# EAGLE design MEM_P2P_1 (EAGLE 6.5.0)

## Sheet 1 of 6
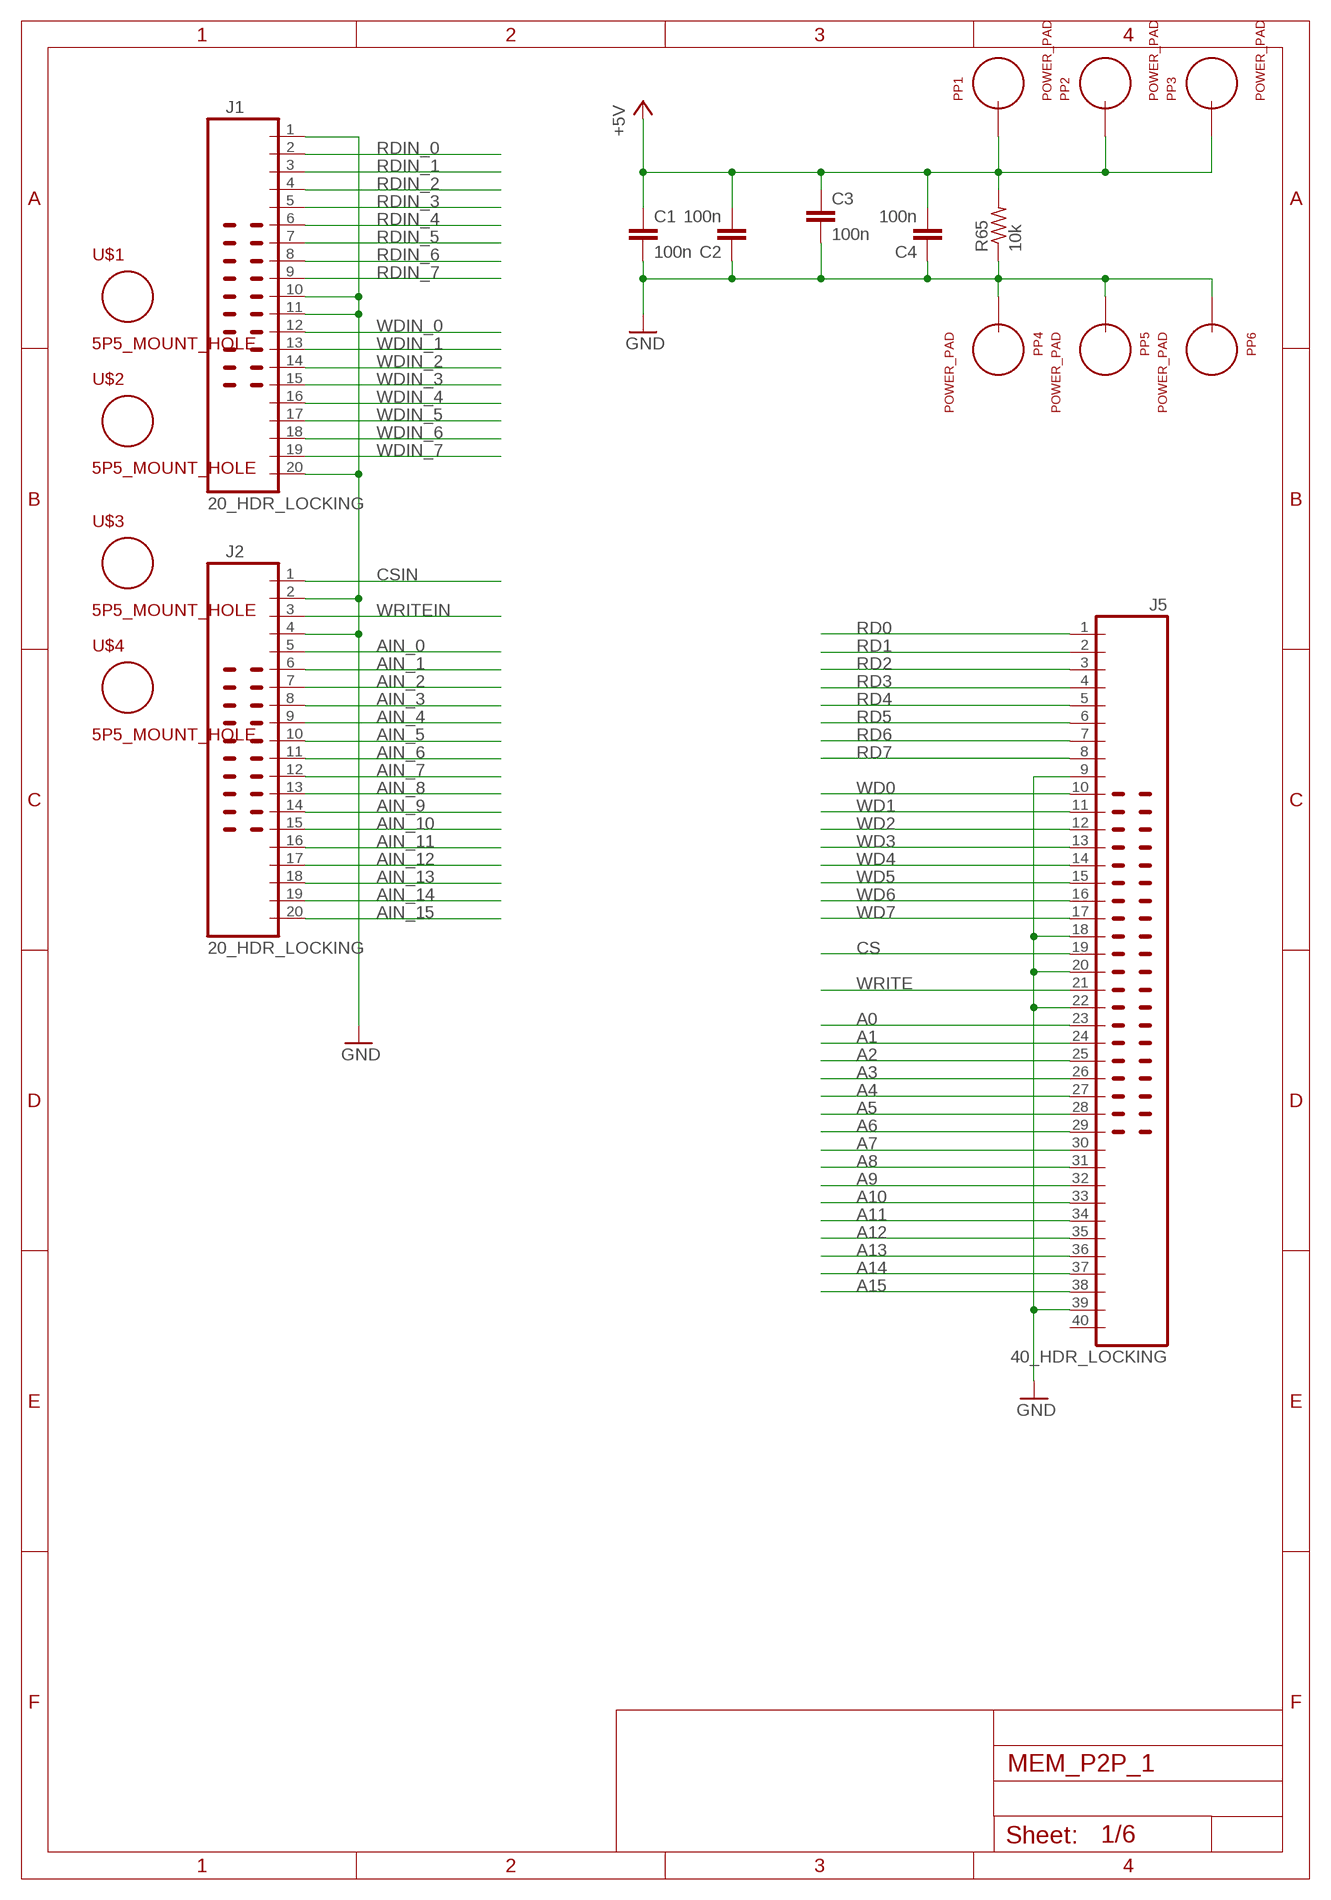
[diagram p0: schematic, sheet 1]

### Parts
C1  100n  C_P2INCH  [CAP_P2INCH]
C2  100n  C_P2INCH  [CAP_P2INCH]
C3  100n  C_P2INCH  [CAP_P2INCH]
C4  100n  C_P2INCH  [CAP_P2INCH]
J1  20_HDR_LOCKING  [20_HDR_LOCKING]
J2  20_HDR_LOCKING  [20_HDR_LOCKING]
J5  40_HDR_LOCKING  [40_HDR_LOCKING]
PP1  POWER_PAD  [POWER_PAD]
PP2  POWER_PAD  [POWER_PAD]
PP3  POWER_PAD  [POWER_PAD]
PP4  POWER_PAD  [POWER_PAD]
PP5  POWER_PAD  [POWER_PAD]
PP6  POWER_PAD  [POWER_PAD]
R65  10k  R_P2INCH  [R_P2INCH]
U$1  5P5_MOUNT_HOLE  [5P5M_HOLE]
U$2  5P5_MOUNT_HOLE  [5P5M_HOLE]
U$3  5P5_MOUNT_HOLE  [5P5M_HOLE]
U$4  5P5_MOUNT_HOLE  [5P5M_HOLE]

### Nets
+5V: C1.1 C2.2 C3.1 C4.2 PP1.1 PP2.1 PP3.1 R65.2 ; also sheet 2,3,4,5,6
A0: J5.23 ; also sheet 5
A1: J5.24 ; also sheet 5
A2: J5.25 ; also sheet 5
A3: J5.26 ; also sheet 5
A4: J5.27 ; also sheet 5
A5: J5.28 ; also sheet 5
A6: J5.29 ; also sheet 5
A7: J5.30 ; also sheet 5
A8: J5.31 ; also sheet 6
A9: J5.32 ; also sheet 6
A10: J5.33 ; also sheet 6
A11: J5.34 ; also sheet 6
A12: J5.35 ; also sheet 6
A13: J5.36 ; also sheet 6
A14: J5.37 ; also sheet 6
A15: J5.38 ; also sheet 6
AIN_0: J2.5 ; also sheet 5
AIN_1: J2.6 ; also sheet 5
AIN_2: J2.7 ; also sheet 5
AIN_3: J2.8 ; also sheet 5
AIN_4: J2.9 ; also sheet 5
AIN_5: J2.10 ; also sheet 5
AIN_6: J2.11 ; also sheet 5
AIN_7: J2.12 ; also sheet 5
AIN_8: J2.13 ; also sheet 6
AIN_9: J2.14 ; also sheet 6
AIN_10: J2.15 ; also sheet 6
AIN_11: J2.16 ; also sheet 6
AIN_12: J2.17 ; also sheet 6
AIN_13: J2.18 ; also sheet 6
AIN_14: J2.19 ; also sheet 6
AIN_15: J2.20 ; also sheet 6
CS: J5.19 ; also sheet 4
CSIN: J2.1 ; also sheet 4
GND: C1.2 C2.1 C3.2 C4.1 J1.1 J1.10 J1.11 J1.20 J2.2 J2.4 J5.9 J5.18 J5.20 J5.22 J5.39 PP4.1 PP5.1 PP6.1 R65.1 ; also sheet 2,3,4,5,6
RD0: J5.1 ; also sheet 2
RD1: J5.2 ; also sheet 2
RD2: J5.3 ; also sheet 2
RD3: J5.4 ; also sheet 2
RD4: J5.5 ; also sheet 2
RD5: J5.6 ; also sheet 2
RD6: J5.7 ; also sheet 2
RD7: J5.8 ; also sheet 2
RDIN_0: J1.2 ; also sheet 2
RDIN_1: J1.3 ; also sheet 2
RDIN_2: J1.4 ; also sheet 2
RDIN_3: J1.5 ; also sheet 2
RDIN_4: J1.6 ; also sheet 2
RDIN_5: J1.7 ; also sheet 2
RDIN_6: J1.8 ; also sheet 2
RDIN_7: J1.9 ; also sheet 2
WD0: J5.10 ; also sheet 3
WD1: J5.11 ; also sheet 3
WD2: J5.12 ; also sheet 3
WD3: J5.13 ; also sheet 3
WD4: J5.14 ; also sheet 3
WD5: J5.15 ; also sheet 3
WD6: J5.16 ; also sheet 3
WD7: J5.17 ; also sheet 3
WDIN_0: J1.12 ; also sheet 3
WDIN_1: J1.13 ; also sheet 3
WDIN_2: J1.14 ; also sheet 3
WDIN_3: J1.15 ; also sheet 3
WDIN_4: J1.16 ; also sheet 3
WDIN_5: J1.17 ; also sheet 3
WDIN_6: J1.18 ; also sheet 3
WDIN_7: J1.19 ; also sheet 3
WRITE: J5.21 ; also sheet 4
WRITEIN: J2.3 ; also sheet 4
Unconnected: J5.40

## Sheet 2 of 6
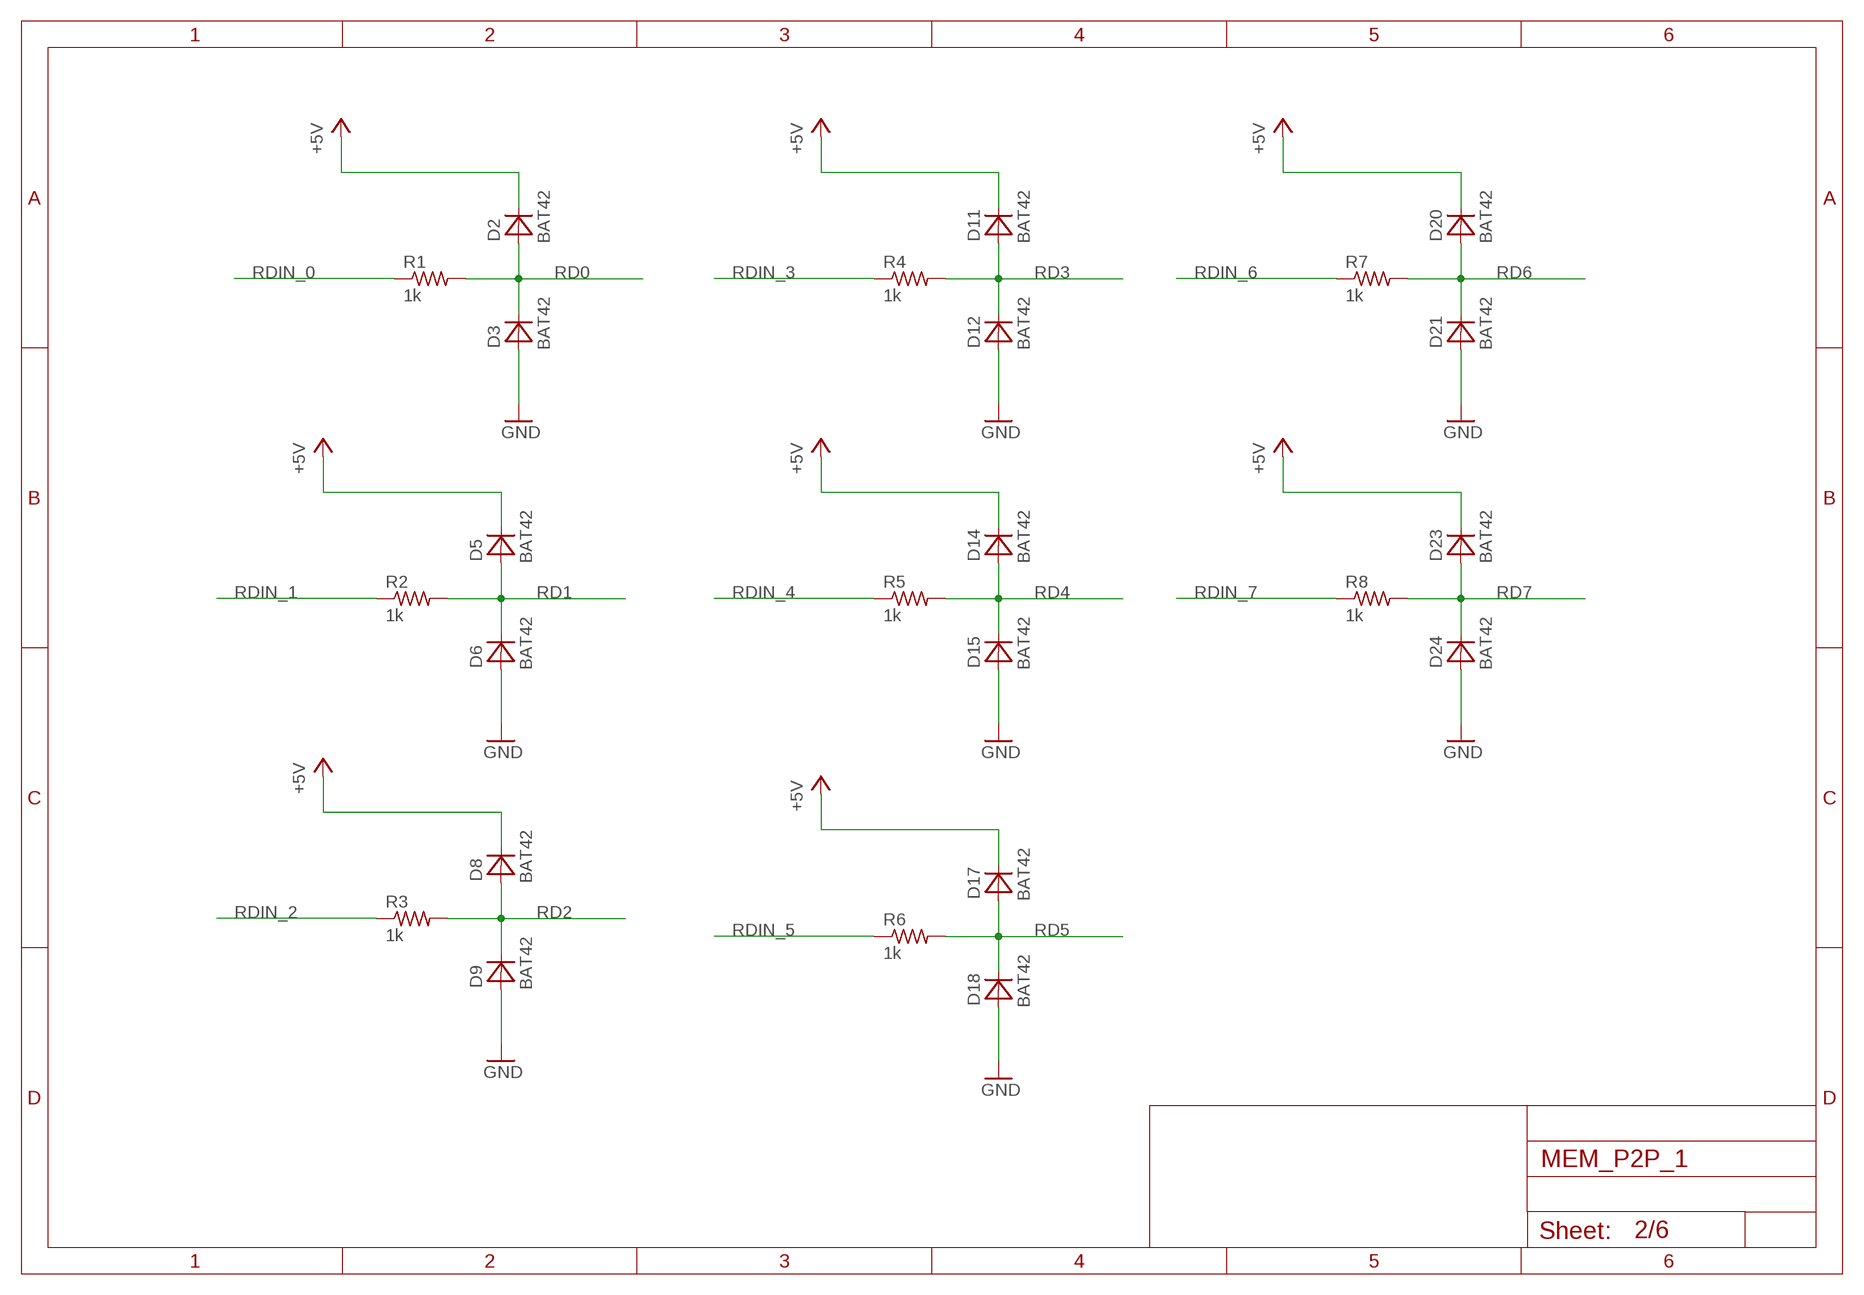
[diagram p1: schematic, sheet 2]

### Parts
D2  BAT42  [DO34-5]
D3  BAT42  [DO34-5]
D5  BAT42  [DO34-5]
D6  BAT42  [DO34-5]
D8  BAT42  [DO34-5]
D9  BAT42  [DO34-5]
D11  BAT42  [DO34-5]
D12  BAT42  [DO34-5]
D14  BAT42  [DO34-5]
D15  BAT42  [DO34-5]
D17  BAT42  [DO34-5]
D18  BAT42  [DO34-5]
D20  BAT42  [DO34-5]
D21  BAT42  [DO34-5]
D23  BAT42  [DO34-5]
D24  BAT42  [DO34-5]
R1  1k  R_P2INCH  [R_P2INCH]
R2  1k  R_P2INCH  [R_P2INCH]
R3  1k  R_P2INCH  [R_P2INCH]
R4  1k  R_P2INCH  [R_P2INCH]
R5  1k  R_P2INCH  [R_P2INCH]
R6  1k  R_P2INCH  [R_P2INCH]
R7  1k  R_P2INCH  [R_P2INCH]
R8  1k  R_P2INCH  [R_P2INCH]

### Nets
+5V: D2.C D5.C D8.C D11.C D14.C D17.C D20.C D23.C ; also sheet 1,3,4,5,6
GND: D3.A D6.A D9.A D12.A D15.A D18.A D21.A D24.A ; also sheet 1,3,4,5,6
RD0: D2.A D3.C R1.2 ; also sheet 1
RD1: D5.A D6.C R2.2 ; also sheet 1
RD2: D8.A D9.C R3.2 ; also sheet 1
RD3: D11.A D12.C R4.2 ; also sheet 1
RD4: D14.A D15.C R5.2 ; also sheet 1
RD5: D17.A D18.C R6.2 ; also sheet 1
RD6: D20.A D21.C R7.2 ; also sheet 1
RD7: D23.A D24.C R8.2 ; also sheet 1
RDIN_0: R1.1 ; also sheet 1
RDIN_1: R2.1 ; also sheet 1
RDIN_2: R3.1 ; also sheet 1
RDIN_3: R4.1 ; also sheet 1
RDIN_4: R5.1 ; also sheet 1
RDIN_5: R6.1 ; also sheet 1
RDIN_6: R7.1 ; also sheet 1
RDIN_7: R8.1 ; also sheet 1

## Sheet 3 of 6
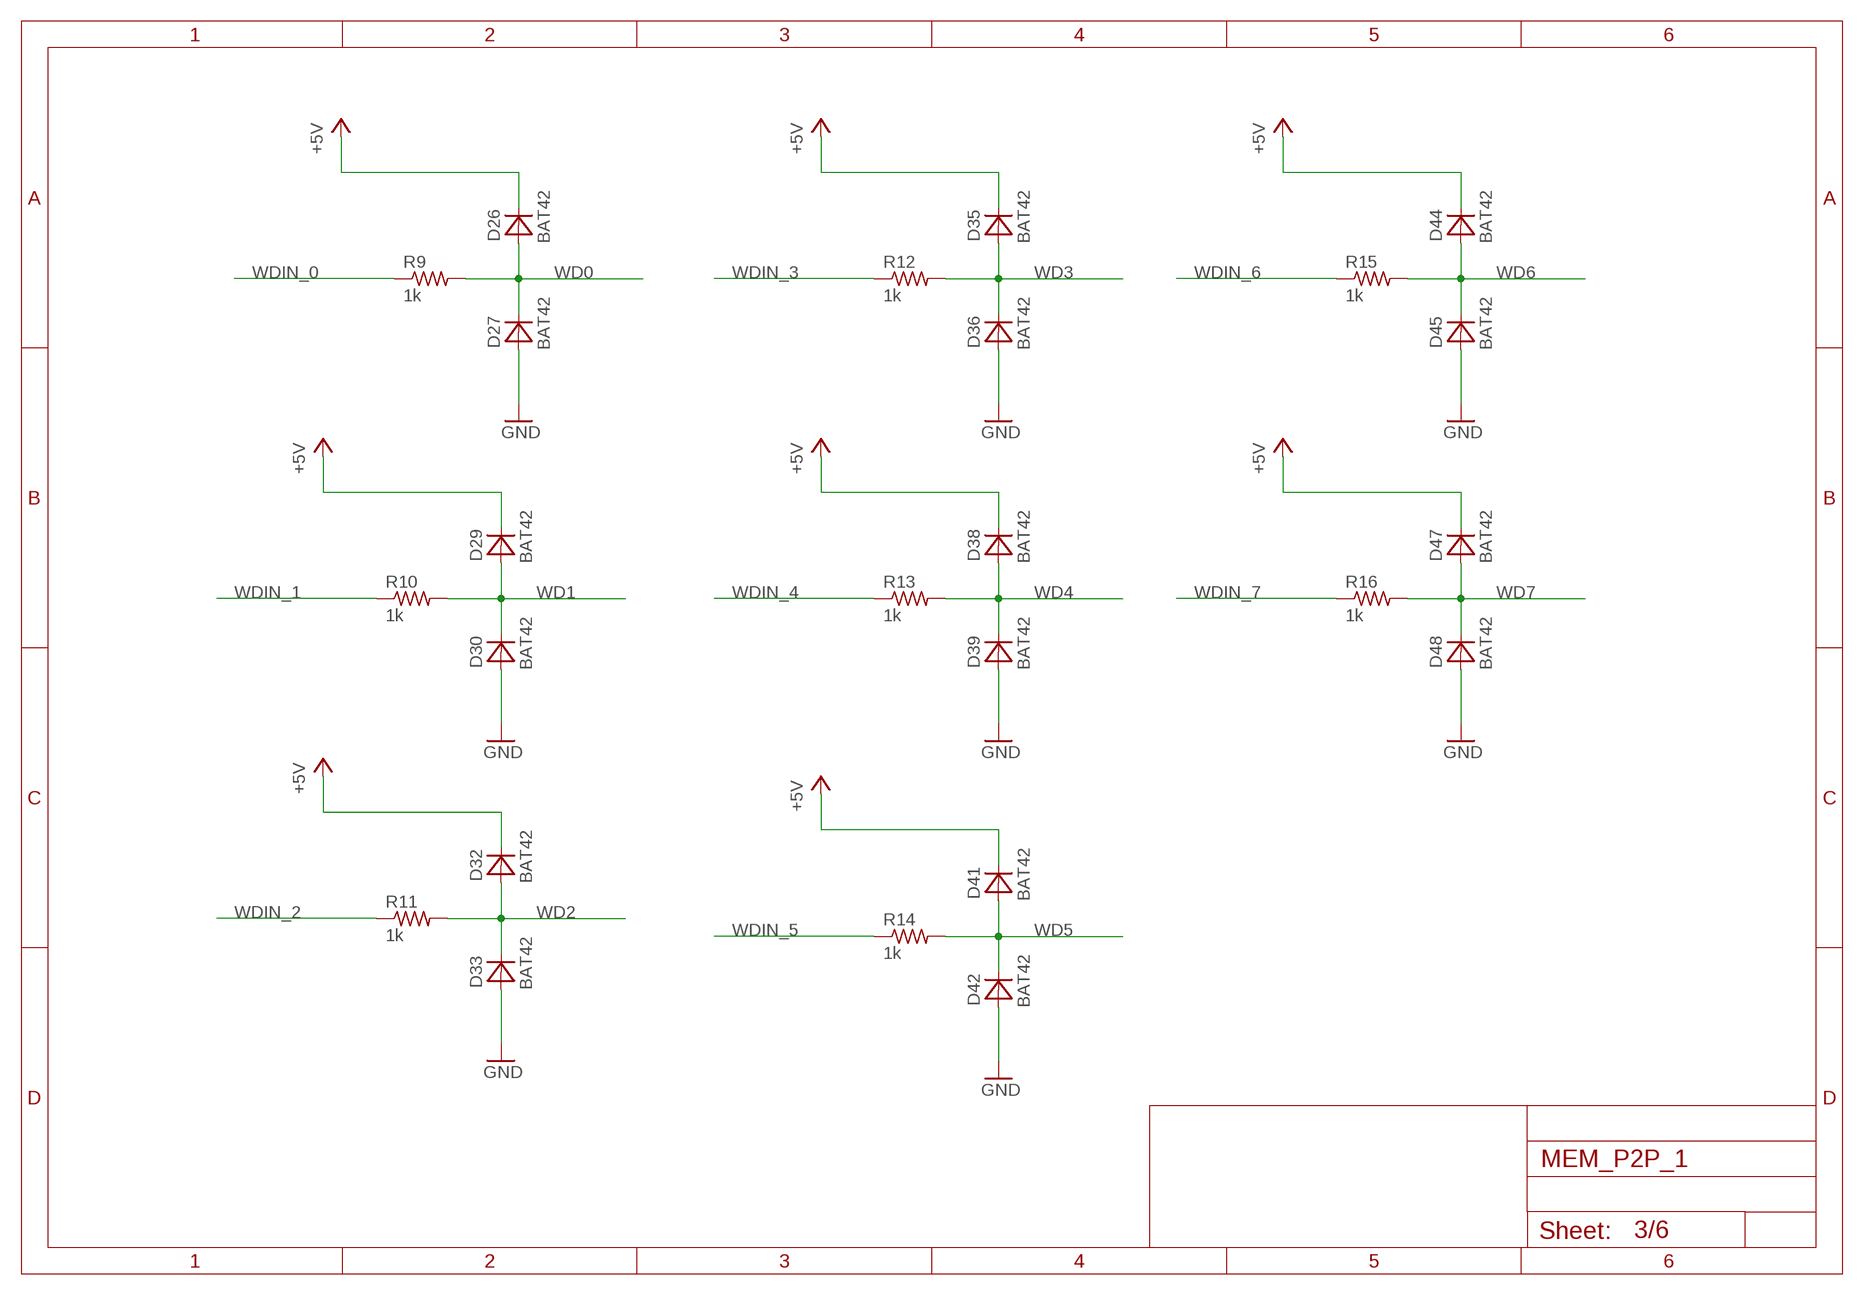
[diagram p2: schematic, sheet 3]

### Parts
D26  BAT42  [DO34-5]
D27  BAT42  [DO34-5]
D29  BAT42  [DO34-5]
D30  BAT42  [DO34-5]
D32  BAT42  [DO34-5]
D33  BAT42  [DO34-5]
D35  BAT42  [DO34-5]
D36  BAT42  [DO34-5]
D38  BAT42  [DO34-5]
D39  BAT42  [DO34-5]
D41  BAT42  [DO34-5]
D42  BAT42  [DO34-5]
D44  BAT42  [DO34-5]
D45  BAT42  [DO34-5]
D47  BAT42  [DO34-5]
D48  BAT42  [DO34-5]
R9  1k  R_P2INCH  [R_P2INCH]
R10  1k  R_P2INCH  [R_P2INCH]
R11  1k  R_P2INCH  [R_P2INCH]
R12  1k  R_P2INCH  [R_P2INCH]
R13  1k  R_P2INCH  [R_P2INCH]
R14  1k  R_P2INCH  [R_P2INCH]
R15  1k  R_P2INCH  [R_P2INCH]
R16  1k  R_P2INCH  [R_P2INCH]

### Nets
+5V: D26.C D29.C D32.C D35.C D38.C D41.C D44.C D47.C ; also sheet 1,2,4,5,6
GND: D27.A D30.A D33.A D36.A D39.A D42.A D45.A D48.A ; also sheet 1,2,4,5,6
WD0: D26.A D27.C R9.2 ; also sheet 1
WD1: D29.A D30.C R10.2 ; also sheet 1
WD2: D32.A D33.C R11.2 ; also sheet 1
WD3: D35.A D36.C R12.2 ; also sheet 1
WD4: D38.A D39.C R13.2 ; also sheet 1
WD5: D41.A D42.C R14.2 ; also sheet 1
WD6: D44.A D45.C R15.2 ; also sheet 1
WD7: D47.A D48.C R16.2 ; also sheet 1
WDIN_0: R9.1 ; also sheet 1
WDIN_1: R10.1 ; also sheet 1
WDIN_2: R11.1 ; also sheet 1
WDIN_3: R12.1 ; also sheet 1
WDIN_4: R13.1 ; also sheet 1
WDIN_5: R14.1 ; also sheet 1
WDIN_6: R15.1 ; also sheet 1
WDIN_7: R16.1 ; also sheet 1

## Sheet 4 of 6
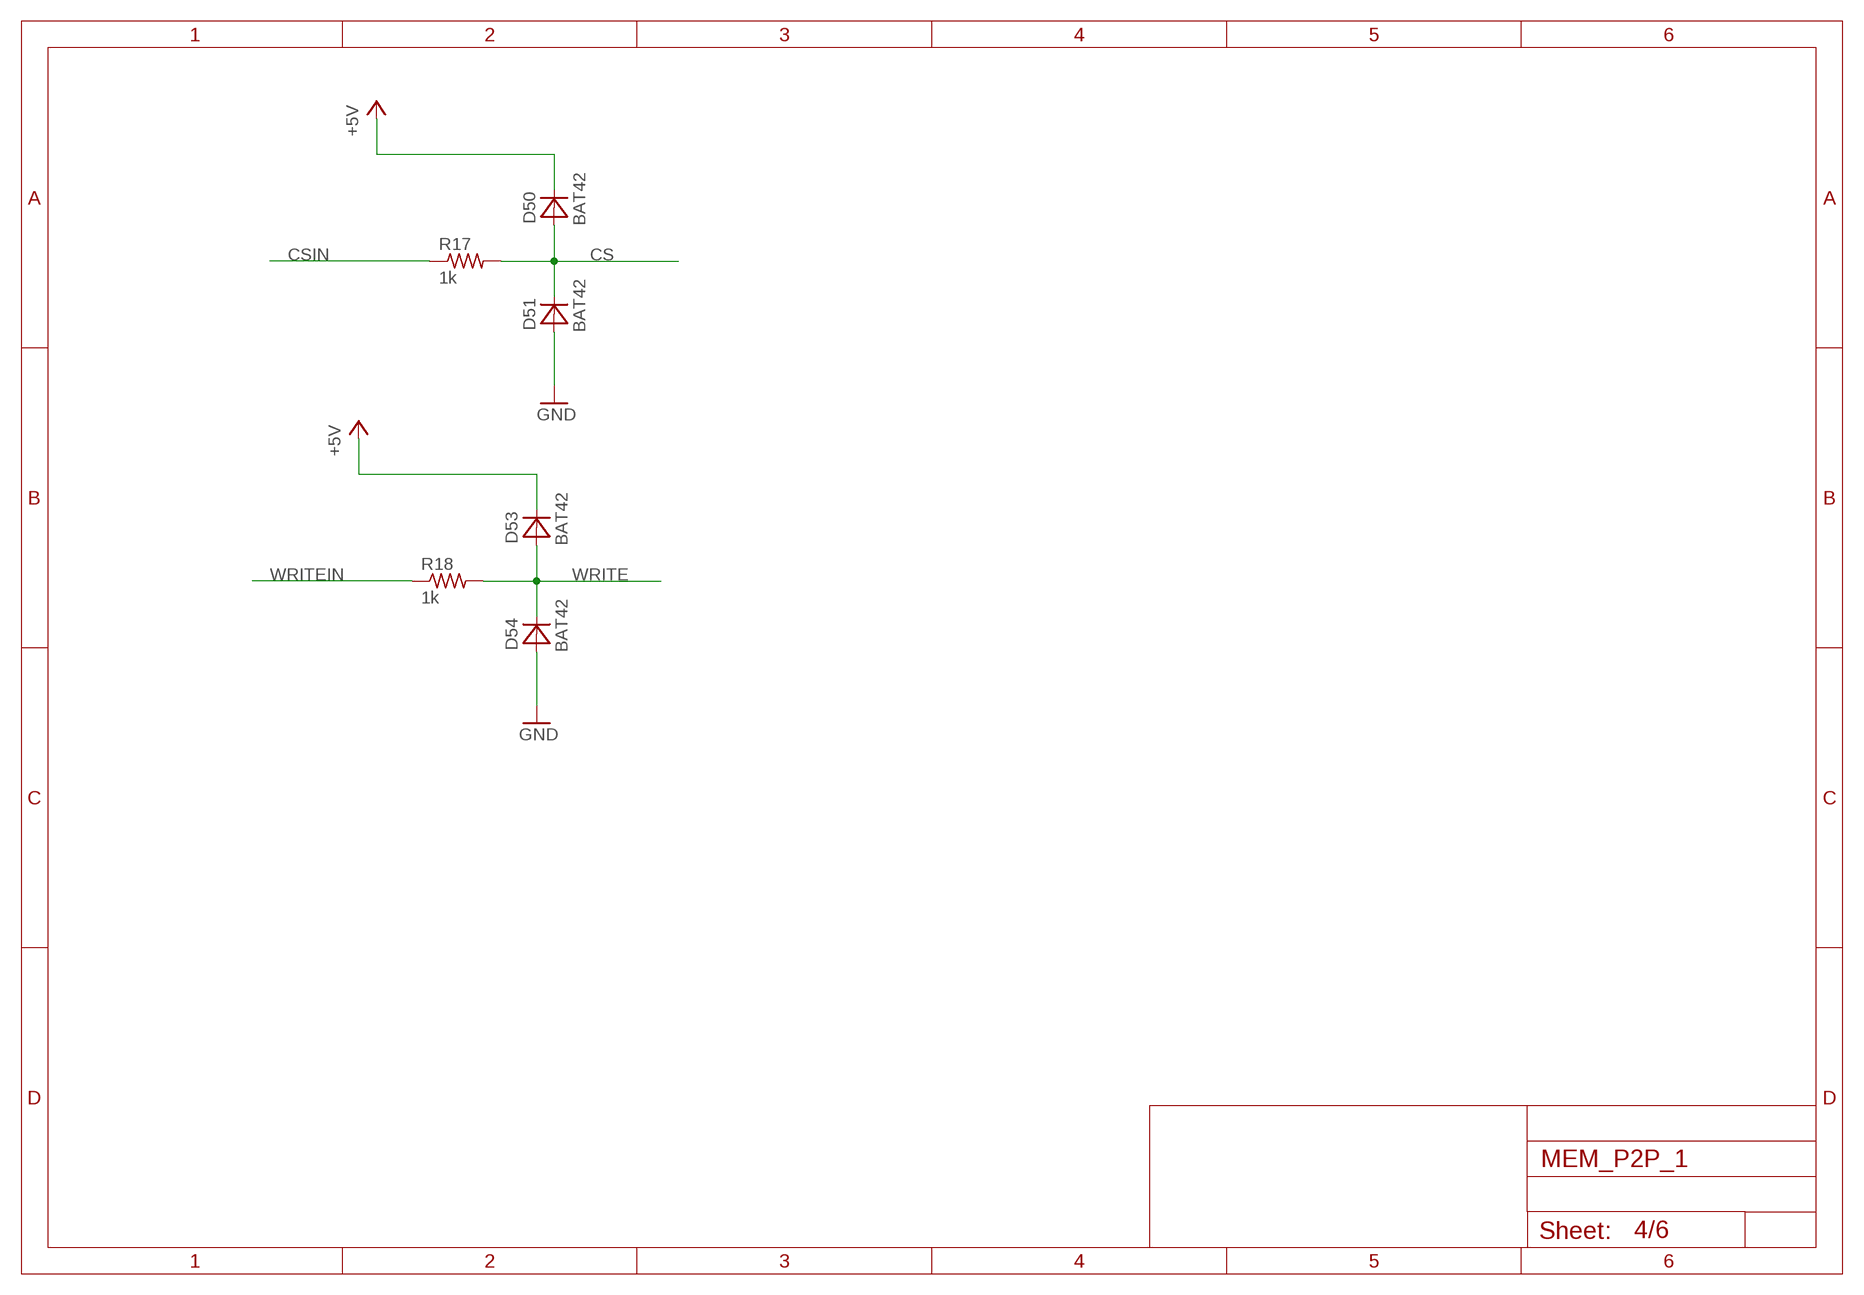
[diagram p3: schematic, sheet 4]

### Parts
D50  BAT42  [DO34-5]
D51  BAT42  [DO34-5]
D53  BAT42  [DO34-5]
D54  BAT42  [DO34-5]
R17  1k  R_P2INCH  [R_P2INCH]
R18  1k  R_P2INCH  [R_P2INCH]

### Nets
+5V: D50.C D53.C ; also sheet 1,2,3,5,6
CS: D50.A D51.C R17.2 ; also sheet 1
CSIN: R17.1 ; also sheet 1
GND: D51.A D54.A ; also sheet 1,2,3,5,6
WRITE: D53.A D54.C R18.2 ; also sheet 1
WRITEIN: R18.1 ; also sheet 1

## Sheet 5 of 6
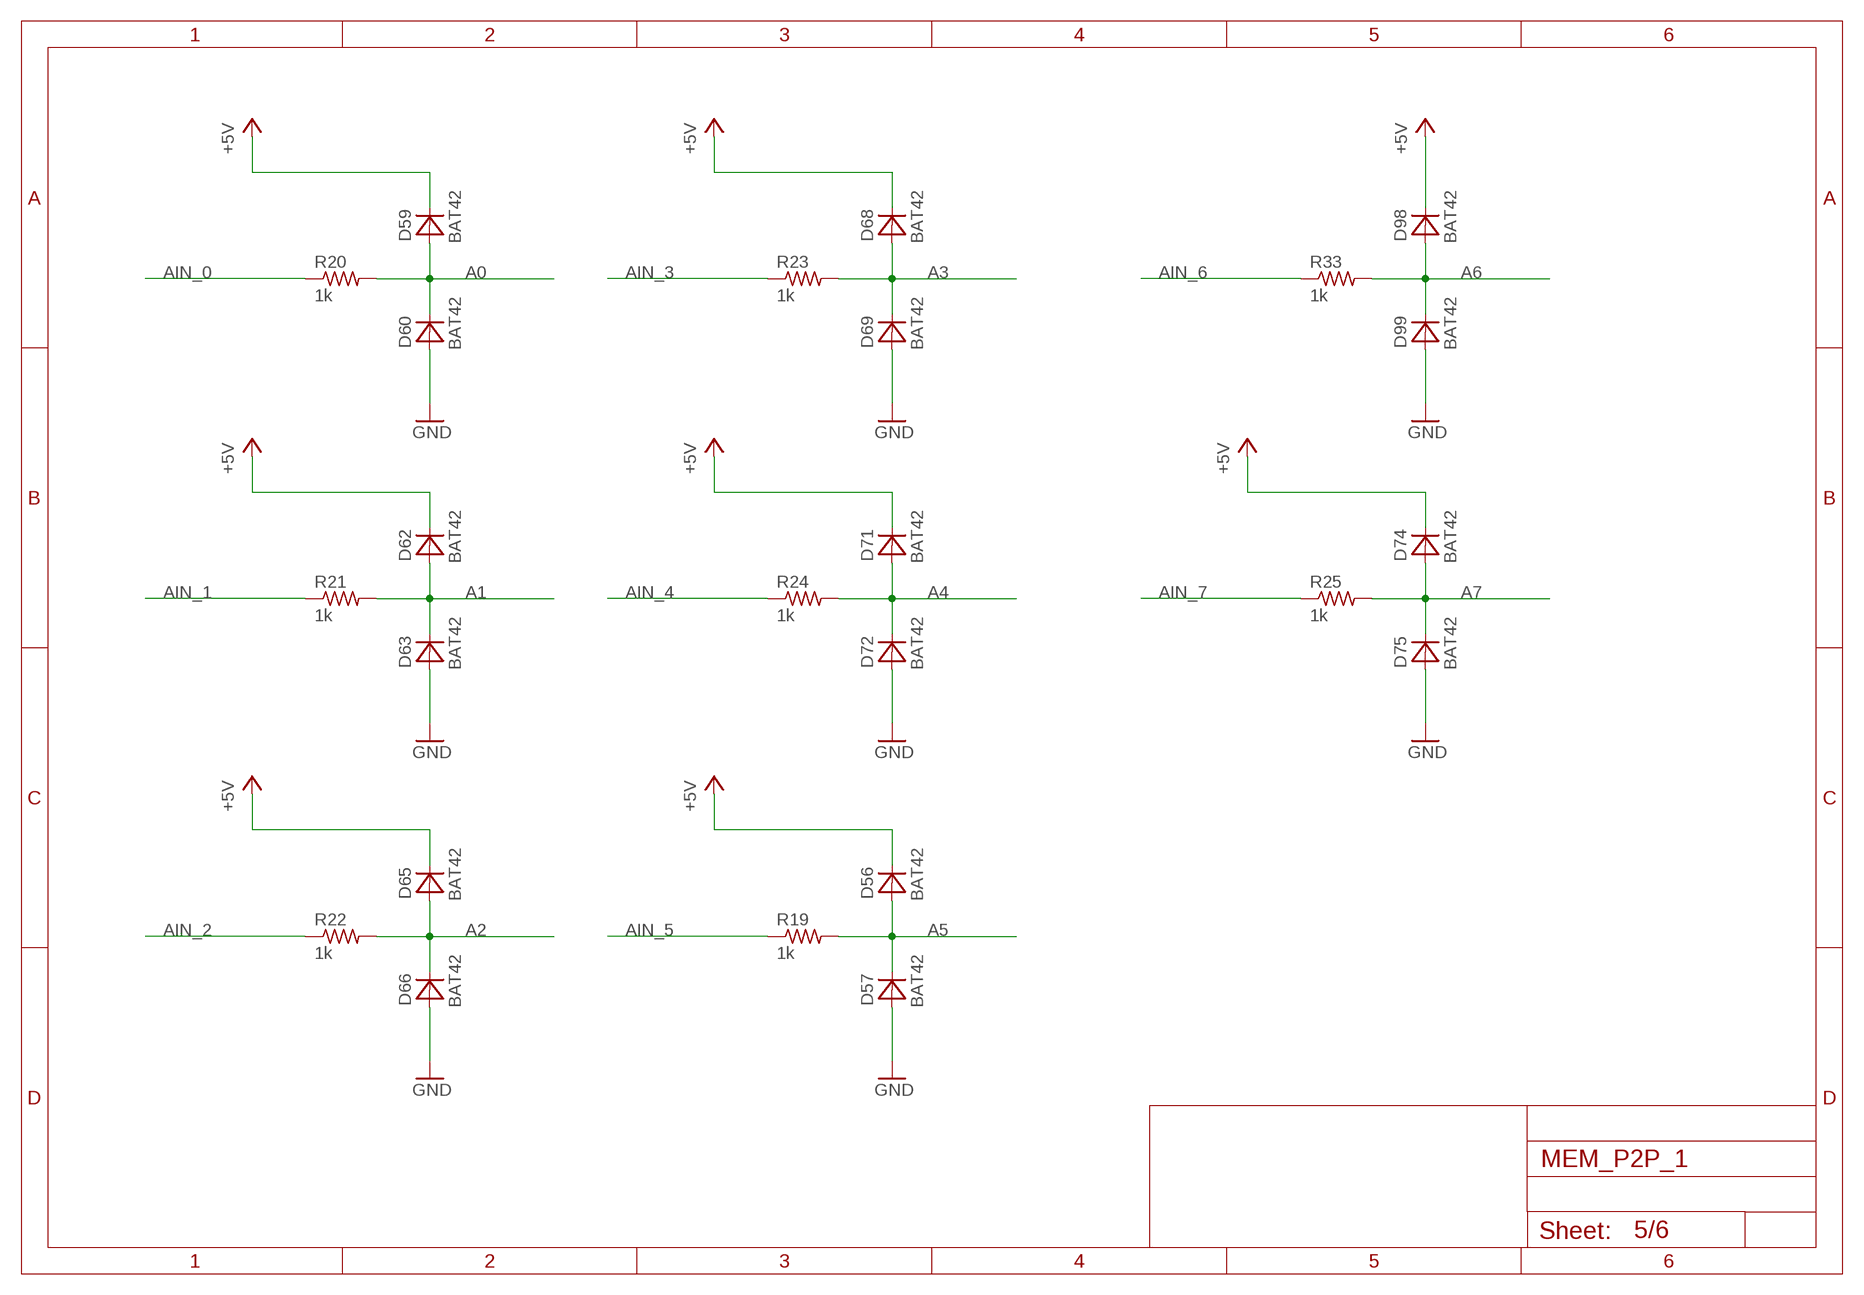
[diagram p4: schematic, sheet 5]

### Parts
D56  BAT42  [DO34-5]
D57  BAT42  [DO34-5]
D59  BAT42  [DO34-5]
D60  BAT42  [DO34-5]
D62  BAT42  [DO34-5]
D63  BAT42  [DO34-5]
D65  BAT42  [DO34-5]
D66  BAT42  [DO34-5]
D68  BAT42  [DO34-5]
D69  BAT42  [DO34-5]
D71  BAT42  [DO34-5]
D72  BAT42  [DO34-5]
D74  BAT42  [DO34-5]
D75  BAT42  [DO34-5]
D98  BAT42  [DO34-5]
D99  BAT42  [DO34-5]
R19  1k  R_P2INCH  [R_P2INCH]
R20  1k  R_P2INCH  [R_P2INCH]
R21  1k  R_P2INCH  [R_P2INCH]
R22  1k  R_P2INCH  [R_P2INCH]
R23  1k  R_P2INCH  [R_P2INCH]
R24  1k  R_P2INCH  [R_P2INCH]
R25  1k  R_P2INCH  [R_P2INCH]
R33  1k  R_P2INCH  [R_P2INCH]

### Nets
+5V: D56.C D59.C D62.C D65.C D68.C D71.C D74.C D98.C ; also sheet 1,2,3,4,6
A0: D59.A D60.C R20.2 ; also sheet 1
A1: D62.A D63.C R21.2 ; also sheet 1
A2: D65.A D66.C R22.2 ; also sheet 1
A3: D68.A D69.C R23.2 ; also sheet 1
A4: D71.A D72.C R24.2 ; also sheet 1
A5: D56.A D57.C R19.2 ; also sheet 1
A6: D98.A D99.C R33.2 ; also sheet 1
A7: D74.A D75.C R25.2 ; also sheet 1
AIN_0: R20.1 ; also sheet 1
AIN_1: R21.1 ; also sheet 1
AIN_2: R22.1 ; also sheet 1
AIN_3: R23.1 ; also sheet 1
AIN_4: R24.1 ; also sheet 1
AIN_5: R19.1 ; also sheet 1
AIN_6: R33.1 ; also sheet 1
AIN_7: R25.1 ; also sheet 1
GND: D57.A D60.A D63.A D66.A D69.A D72.A D75.A D99.A ; also sheet 1,2,3,4,6

## Sheet 6 of 6
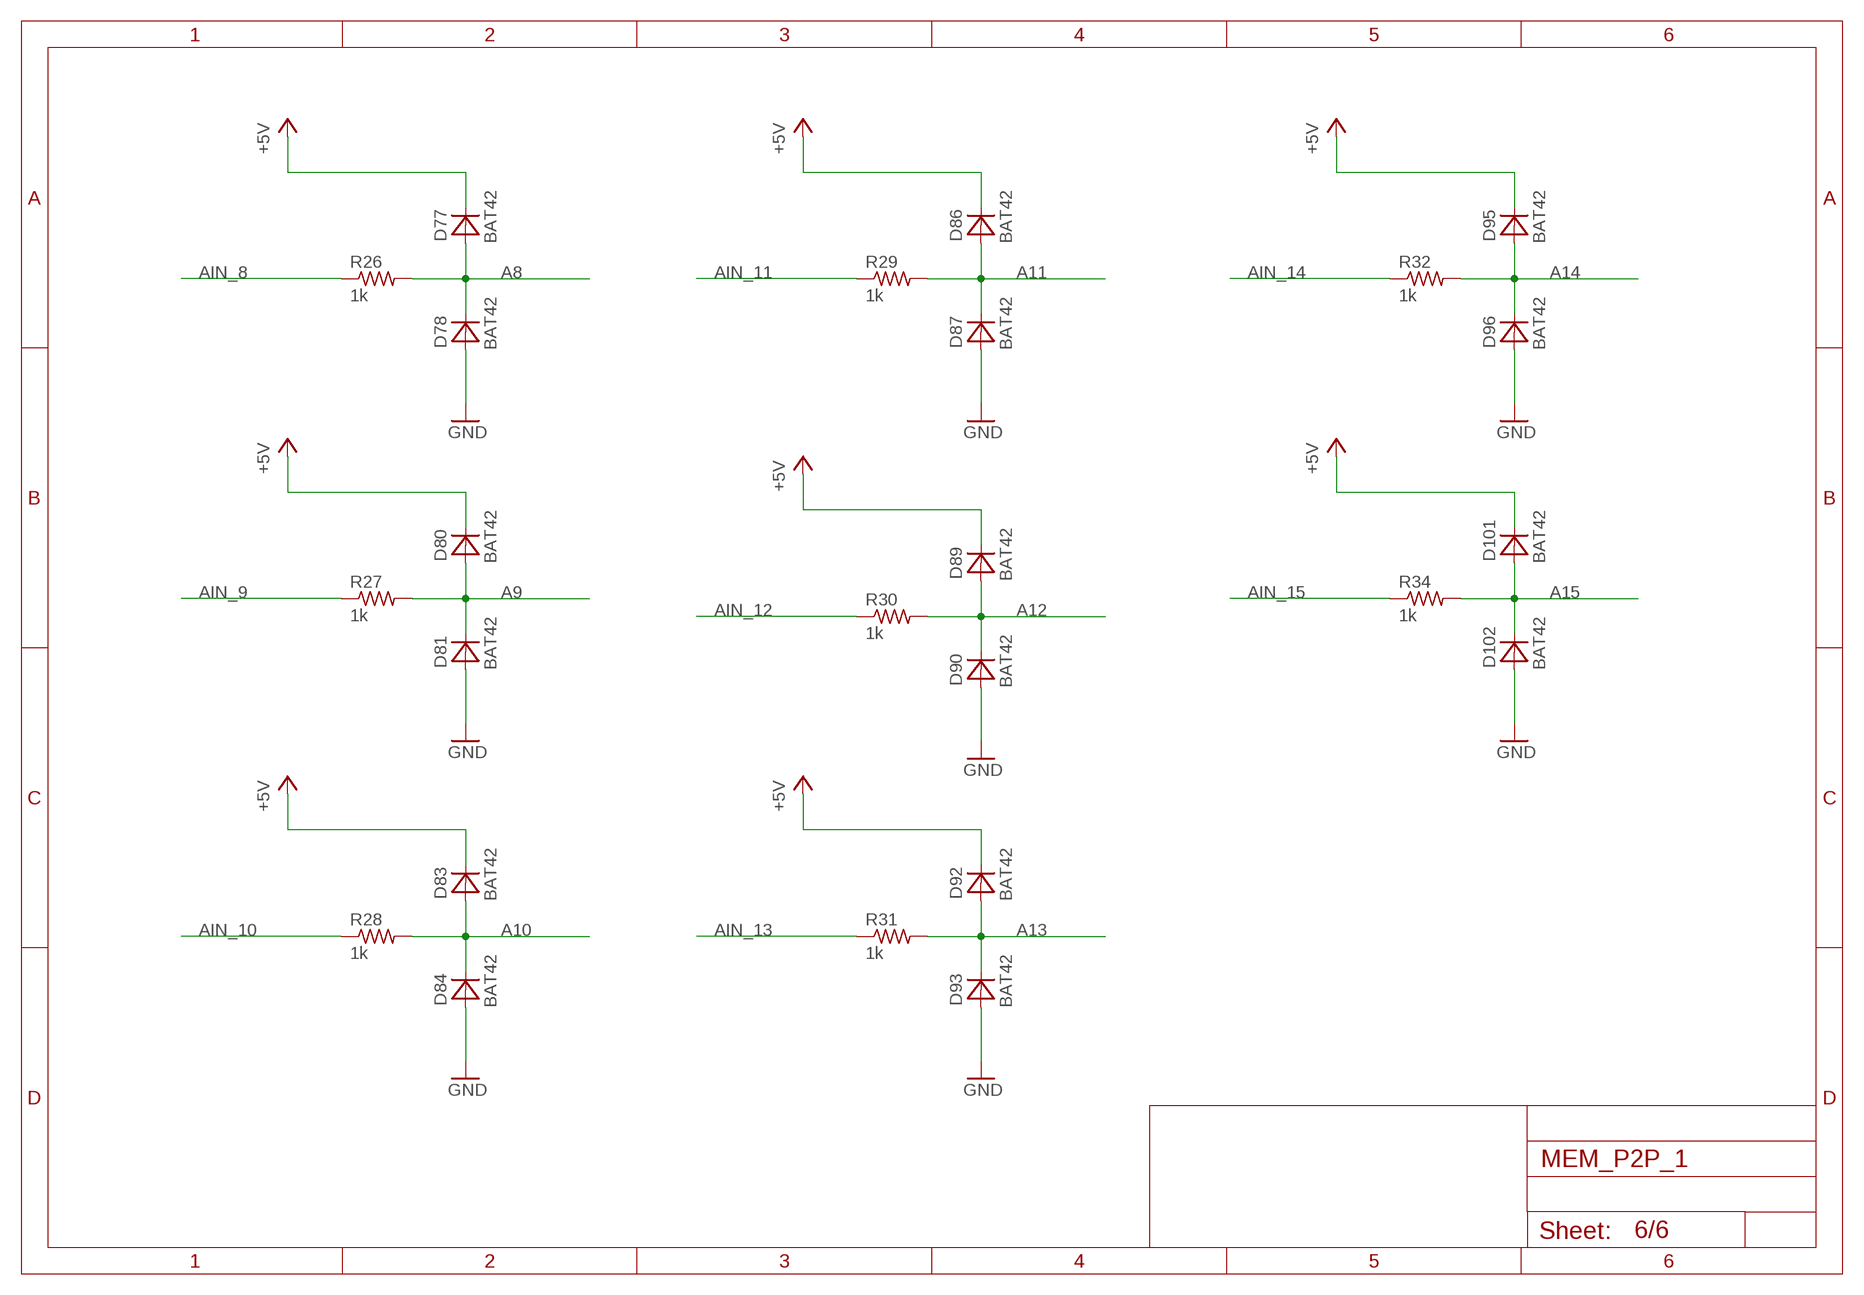
[diagram p5: schematic, sheet 6]

### Parts
D77  BAT42  [DO34-5]
D78  BAT42  [DO34-5]
D80  BAT42  [DO34-5]
D81  BAT42  [DO34-5]
D83  BAT42  [DO34-5]
D84  BAT42  [DO34-5]
D86  BAT42  [DO34-5]
D87  BAT42  [DO34-5]
D89  BAT42  [DO34-5]
D90  BAT42  [DO34-5]
D92  BAT42  [DO34-5]
D93  BAT42  [DO34-5]
D95  BAT42  [DO34-5]
D96  BAT42  [DO34-5]
D101  BAT42  [DO34-5]
D102  BAT42  [DO34-5]
R26  1k  R_P2INCH  [R_P2INCH]
R27  1k  R_P2INCH  [R_P2INCH]
R28  1k  R_P2INCH  [R_P2INCH]
R29  1k  R_P2INCH  [R_P2INCH]
R30  1k  R_P2INCH  [R_P2INCH]
R31  1k  R_P2INCH  [R_P2INCH]
R32  1k  R_P2INCH  [R_P2INCH]
R34  1k  R_P2INCH  [R_P2INCH]

### Nets
+5V: D77.C D80.C D83.C D86.C D89.C D92.C D95.C D101.C ; also sheet 1,2,3,4,5
A8: D77.A D78.C R26.2 ; also sheet 1
A9: D80.A D81.C R27.2 ; also sheet 1
A10: D83.A D84.C R28.2 ; also sheet 1
A11: D86.A D87.C R29.2 ; also sheet 1
A12: D89.A D90.C R30.2 ; also sheet 1
A13: D92.A D93.C R31.2 ; also sheet 1
A14: D95.A D96.C R32.2 ; also sheet 1
A15: D101.A D102.C R34.2 ; also sheet 1
AIN_8: R26.1 ; also sheet 1
AIN_9: R27.1 ; also sheet 1
AIN_10: R28.1 ; also sheet 1
AIN_11: R29.1 ; also sheet 1
AIN_12: R30.1 ; also sheet 1
AIN_13: R31.1 ; also sheet 1
AIN_14: R32.1 ; also sheet 1
AIN_15: R34.1 ; also sheet 1
GND: D78.A D81.A D84.A D87.A D90.A D93.A D96.A D102.A ; also sheet 1,2,3,4,5

## Library data of the parts
C1-C4 = MyLib:C_P2INCH
D2 D3 D5 D6 D8 D9 D11 D12 D14 D15 D17 D18 D20 D21 D23 D24 D26 D27 D29 D30 D32 D33 D35 D36 D38 D39 D41 D42 D44 D45 D47 D48 D50 D51 D53 D54 D56 D57 D59 D60 D62 D63 D65 D66 D68 D69 D71 D72 D74 D75 D77 D78 D80 D81 D83 D84 D86 D87 D89 D90 D92 D93 D95 D96 D98 D99 D101 D102 = MyLib:BAT42
J1 J2 = MyLib:20_HDR_LOCKING
J5 = MyLib:40_HDR_LOCKING
PP1-PP6 = MyLib:POWER_PAD
R1-R34 R65 = MyLib:R_P2INCH
U$1-U$4 = MyLib:5P5_MOUNT_HOLE

## Board
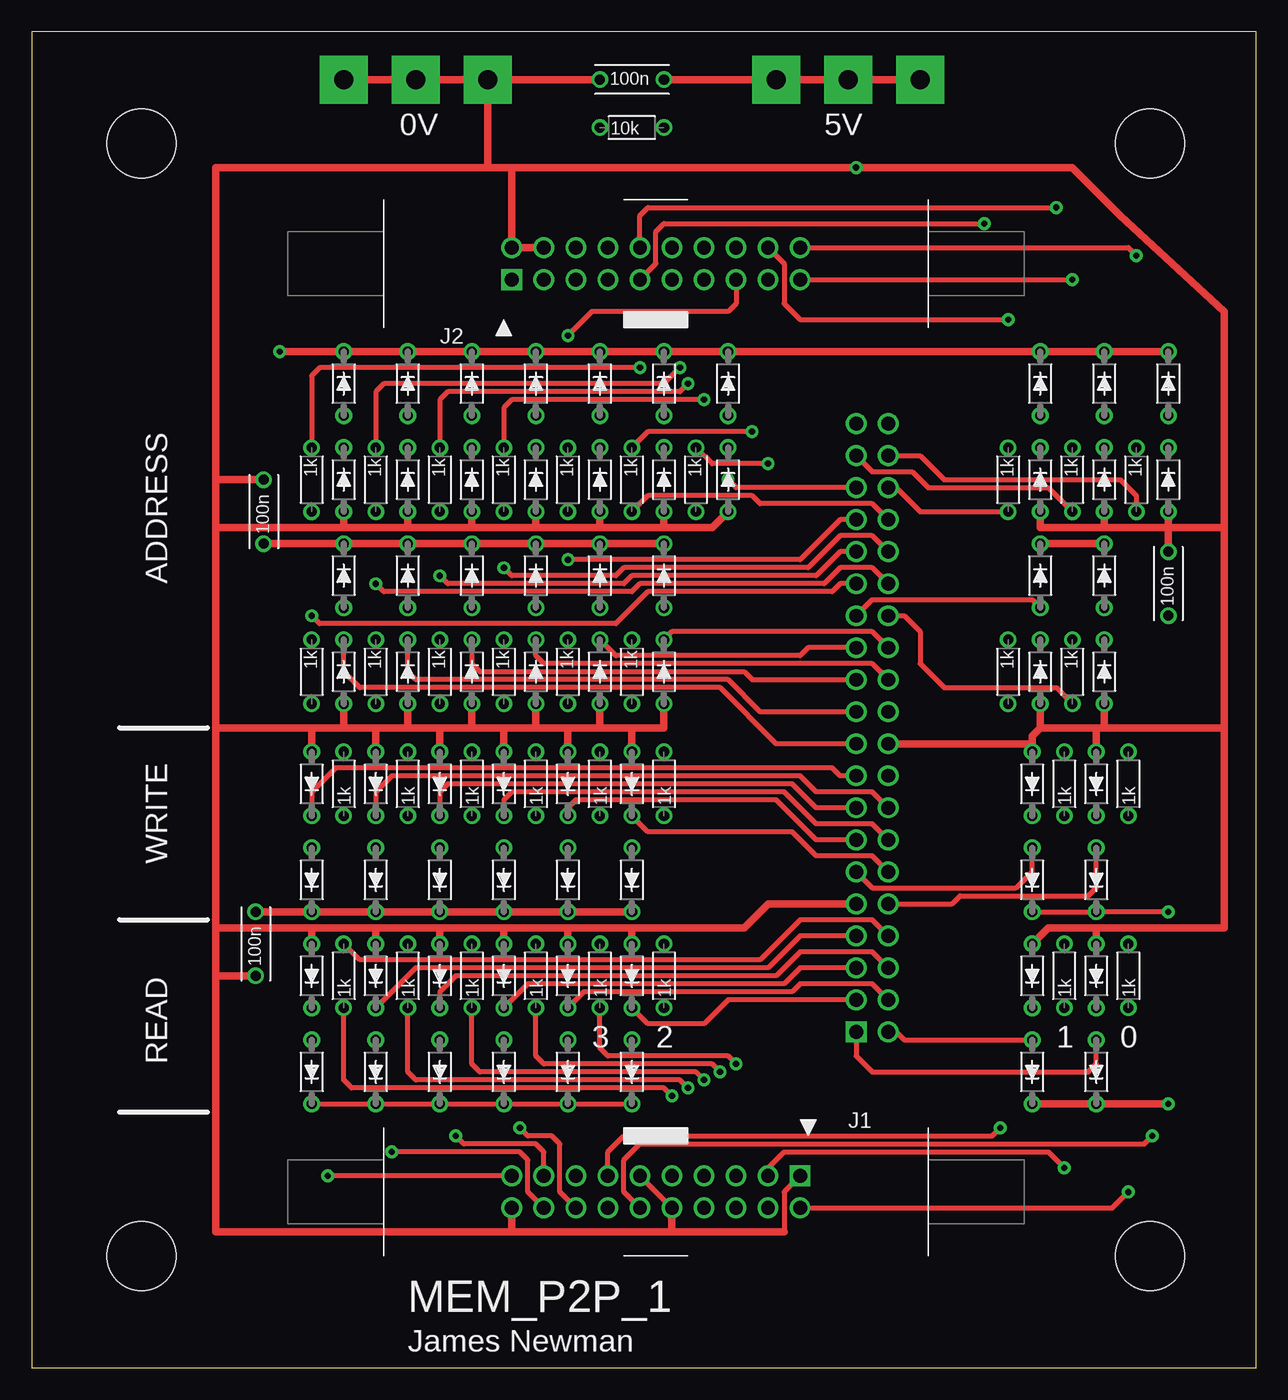
[diagram p6: board, top side]
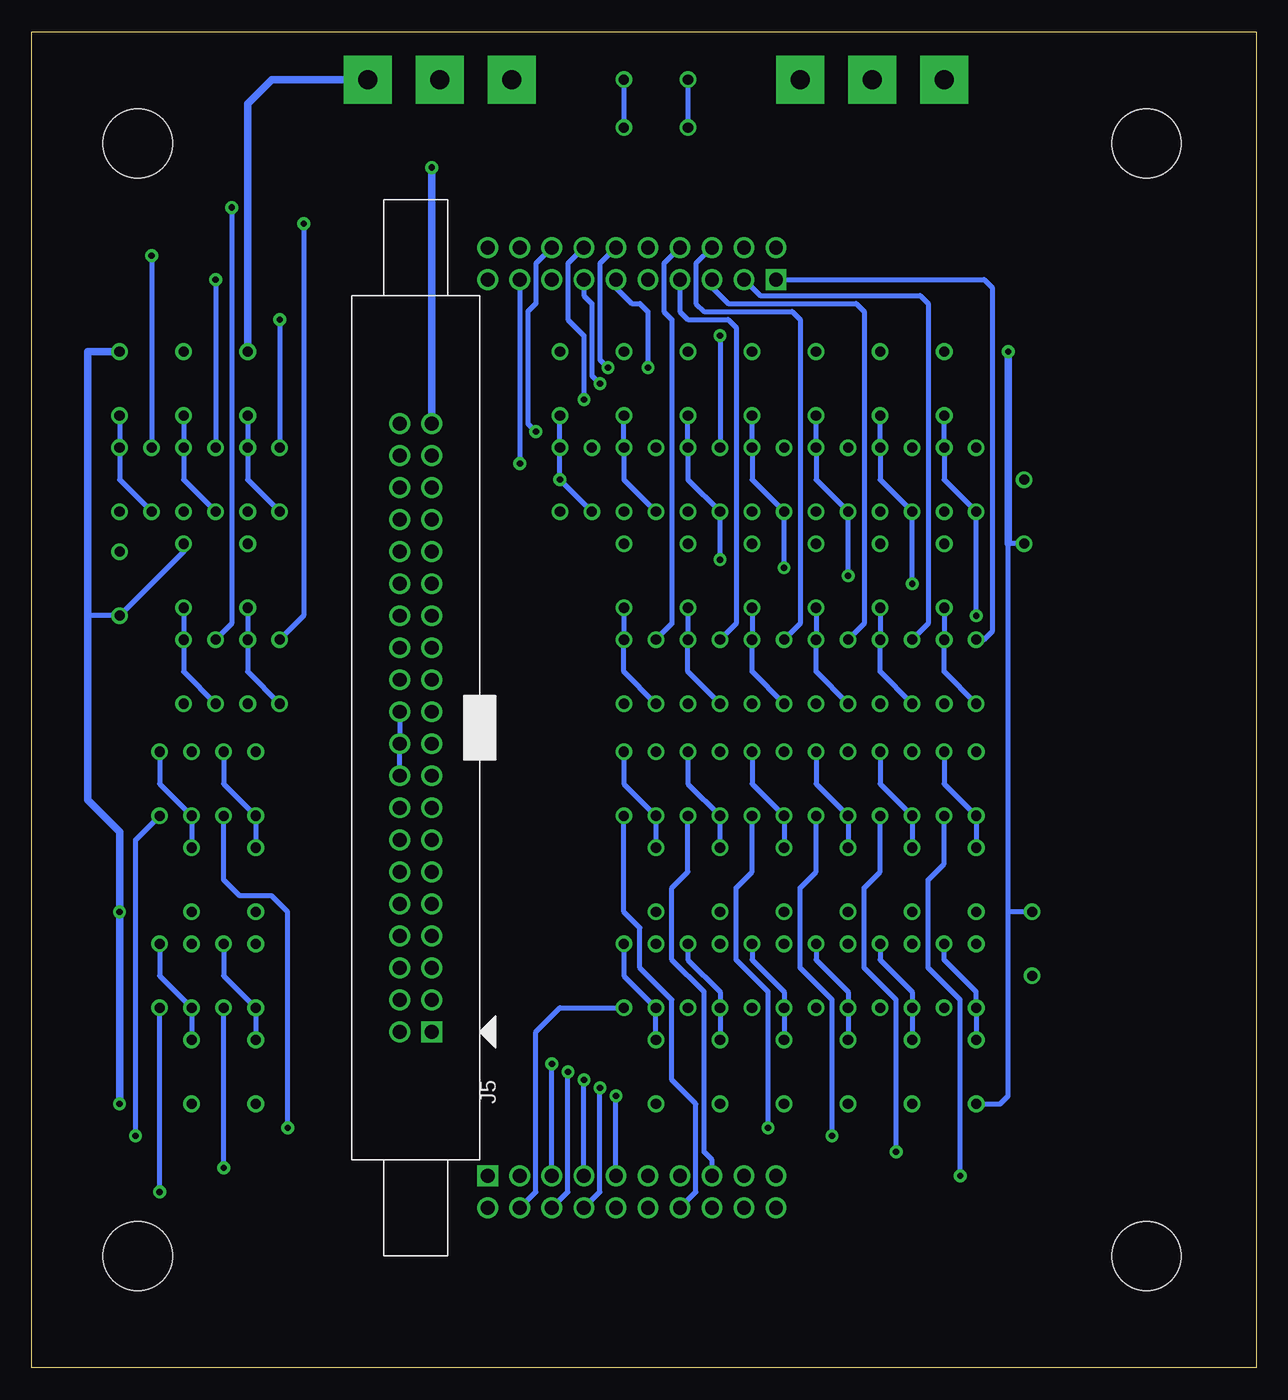
[diagram p7: board, bottom side, seen from below]

Size 97.16 x 106.05 mm. Coordinates in mm from the lower left corner, seen from the top.
Outline: 97.16,106.05 0,106.05 0,0 97.16,0 97.16,106.05
Copper layers (1*16): Top 0.035mm / dielectric 1.5mm / Bottom 0.035mm
Design rules "processor_rules_2layer *": minimum track width 8mil, minimum drill 14mil, track to track 8mil, track to pad 8mil, pad to pad 8mil, via to via 8mil, smd to smd 8mil, copper to edge 40mil, drill to drill 8mil, minimum pad ring 10mil, minimum via ring 8mil, stop-mask expansion 4mil, vias tented up to drill 20mil, thermal gap 10mil

### Footprints (pad centres in the part's own frame; a part is rotated, then mirrored left to right if it is on the bottom)
CAP_P2INCH = drill 0.8: 1 -2.54,0; 2 2.54,0
DO34-5 = drill 0.813: A 2.54,0; C -2.54,0
20_HDR_LOCKING = drill 1.1 square: 1 -1.27,11.43 | drill 1.1: 2 1.27,11.43; 3 -1.27,8.89; 4 1.27,8.89; 5 -1.27,6.35; 6 1.27,6.35; 7 -1.27,3.81; 8 1.27,3.81; 9 -1.27,1.27; 10 1.27,1.27; 11 -1.27,-1.27; 12 1.27,-1.27; 13 -1.27,-3.81; 14 1.27,-3.81; 15 -1.27,-6.35; 16 1.27,-6.35; 17 -1.27,-8.89; 18 1.27,-8.89; 19 -1.27,-11.43; 20 1.27,-11.43
40_HDR_LOCKING = drill 1.1 square: 1 -1.27,24.13 | drill 1.1: 2 1.27,24.13; 3 -1.27,21.59; 4 1.27,21.59; 5 -1.27,19.05; 6 1.27,19.05; 7 -1.27,16.51; 8 1.27,16.51; 9 -1.27,13.97; 10 1.27,13.97; 11 -1.27,11.43; 12 1.27,11.43; 13 -1.27,8.89; 14 1.27,8.89; 15 -1.27,6.35; 16 1.27,6.35; 17 -1.27,3.81; 18 1.27,3.81; 19 -1.27,1.27; 20 1.27,1.27; 21 -1.27,-1.27; 22 1.27,-1.27; 23 -1.27,-3.81; 24 1.27,-3.81; 25 -1.27,-6.35; 26 1.27,-6.35; 27 -1.27,-8.89; 28 1.27,-8.89; 29 -1.27,-11.43; 30 1.27,-11.43; 31 -1.27,-13.97; 32 1.27,-13.97; 33 -1.27,-16.51; 34 1.27,-16.51; 35 -1.27,-19.05; 36 1.27,-19.05; 37 -1.27,-21.59; 38 1.27,-21.59; 39 -1.27,-24.13; 40 1.27,-24.13
POWER_PAD = drill 1.5 pad 3.81 square: 1 0,0
R_P2INCH = drill 0.8: 1 -2.54,0; 2 2.54,0
5P5M_HOLE = hole 5.5: 0,0

### Placement (x,y rotation side)
C1  90.17,62.23 90 top
C2  17.78,33.66 90 top
C3  18.41,67.94 90 top
C4  47.62,102.23 0 top
D2  84.45,23.5 90 top
D3  84.45,31.11 90 top
D5  79.38,23.5 90 top
D6  79.38,31.11 90 top
D8  47.62,23.5 90 top
D9  47.62,31.11 90 top
D11  42.55,23.5 90 top
D12  42.55,31.11 90 top
D14  37.47,23.5 90 top
D15  37.47,31.11 90 top
D17  32.38,23.5 90 top
D18  32.38,31.11 90 top
D20  27.3,23.5 90 top
D21  27.3,31.11 90 top
D23  22.23,23.5 90 top
D24  22.23,31.11 90 top
D26  84.45,38.73 90 top
D27  84.45,46.35 90 top
D29  79.38,38.73 90 top
D30  79.38,46.35 90 top
D32  47.62,38.73 90 top
D33  47.62,46.35 90 top
D35  42.55,38.73 90 top
D36  42.55,46.35 90 top
D38  37.47,38.73 90 top
D39  37.47,46.35 90 top
D41  32.38,38.73 90 top
D42  32.38,46.35 90 top
D44  27.3,38.73 90 top
D45  27.3,46.35 90 top
D47  22.23,38.73 90 top
D48  22.23,46.35 90 top
D50  24.77,62.87 270 top
D51  24.77,55.24 270 top
D53  29.84,62.87 270 top
D54  29.84,55.24 270 top
D56  85.09,62.87 270 top
D57  85.09,55.24 270 top
D59  34.92,62.87 270 top
D60  34.92,55.24 270 top
D62  40.01,62.87 270 top
D63  40.01,55.24 270 top
D65  45.09,62.87 270 top
D66  45.09,55.24 270 top
D68  50.16,62.87 270 top
D69  50.16,55.24 270 top
D71  80.01,62.87 270 top
D72  80.01,55.24 270 top
D74  29.84,78.11 270 top
D75  29.84,70.48 270 top
D77  34.92,78.11 270 top
D78  34.92,70.48 270 top
D80  40.01,78.11 270 top
D81  40.01,70.48 270 top
D83  45.09,78.11 270 top
D84  45.09,70.48 270 top
D86  50.16,78.11 270 top
D87  50.16,70.48 270 top
D89  55.24,78.11 270 top
D90  55.24,70.48 270 top
D92  80.01,78.11 270 top
D93  80.01,70.48 270 top
D95  85.09,78.11 270 top
D96  85.09,70.48 270 top
D98  24.77,78.11 270 top
D99  24.77,70.48 270 top
D101  90.17,78.11 270 top
D102  90.17,70.48 270 top
J1  49.53,13.97 270 top
J2  49.53,87.63 90 top
J5  66.67,50.8 180 bottom
PP1  59.05,102.23 0 top
PP2  64.77,102.23 0 top
PP3  70.48,102.23 0 top
PP4  36.2,102.23 0 top
PP5  30.48,102.23 0 top
PP6  24.77,102.23 0 top
R1  87,31.11 90 top
R2  81.92,31.11 90 top
R3  50.16,31.11 90 top
R4  45.09,31.11 90 top
R5  40.01,31.11 90 top
R6  34.92,31.11 90 top
R7  29.84,31.11 90 top
R8  24.77,31.11 90 top
R9  87,46.35 90 top
R10  81.92,46.35 90 top
R11  50.16,46.35 90 top
R12  45.09,46.35 90 top
R13  40.01,46.35 90 top
R14  34.92,46.35 90 top
R15  29.84,46.35 90 top
R16  24.77,46.35 90 top
R17  22.23,55.24 270 top
R18  27.3,55.24 270 top
R19  82.55,55.24 270 top
R20  32.38,55.24 270 top
R21  37.47,55.24 270 top
R22  42.55,55.24 270 top
R23  47.62,55.24 270 top
R24  77.47,55.24 270 top
R25  27.3,70.48 270 top
R26  32.38,70.48 270 top
R27  37.47,70.48 270 top
R28  42.55,70.48 270 top
R29  47.62,70.48 270 top
R30  52.7,70.48 270 top
R31  77.47,70.48 270 top
R32  82.55,70.48 270 top
R33  22.23,70.48 270 top
R34  87.63,70.48 270 top
R65  47.62,98.42 0 top
U$1  88.73,8.89 180 top
U$2  88.73,97.16 180 top
U$3  8.73,97.16 0 top
U$4  8.73,8.89 180 top

### Tracks (layer width: path | path; a pad name or v marks a point on that pad's centre or on a via)
+5V  (via drill 0.5 pad 1.02)
  Top 0.406: D62.C 40.64,65.41 | 44.45,65.41 D65.C | D23.C D20.C D17.C D14.C D11.C D8.C | D29.C D26.C v90.17,36.2
  Top 0.61: D62.C D59.C D53.C D50.C C3.1 | 40.64,65.41 44.45,65.41 | D65.C D68.C | D32.C D35.C D38.C D41.C D44.C D47.C C2.2 | D101.C D95.C D92.C D89.C D86.C D83.C D80.C D77.C D74.C D98.C v19.68,80.64 | D71.C D56.C | D5.C D2.C v90.17,20.95 | C4.2 PP1.1 PP2.1 PP3.1
  Bottom 0.406: D56.C 85.09,64.77 C1.1 92.71,59.69 | C4.2 R65.2 | D23.C 20.32,20.95 19.68,21.59 19.68,36.2 | 19.68,36.2 19.68,65.41 C3.1 | C2.2 19.68,36.2
  Bottom 0.61: v90.17,20.95 v90.17,36.2 90.17,42.55 92.71,45.09 92.71,59.69 92.71,80.64 D101.C | 19.68,65.41 v19.68,80.64 | PP3.1 78.11,102.23 80.01,100.33 D92.C
A0
  Top 0.406: D60.C 34.92,55.88 35.56,55.24 56.52,55.24 57.15,54.61 J5.23
  Bottom 0.406: D59.A D60.C 34.92,55.24 R20.2
A1
  Top 0.406: J5.24 66.67,55.88 40.64,55.88 40.01,56.52 D63.C
  Bottom 0.406: D62.A D63.C 40.01,55.24 R21.2
A2
  Top 0.406: J5.25 61.59,57.15 60.96,56.52 46.35,56.52 D66.C
  Bottom 0.406: D65.A D66.C 45.09,55.24 R22.2
A3
  Top 0.406: J5.26 66.67,58.42 50.8,58.42 D69.C
  Bottom 0.406: D68.A D69.C 50.16,55.24 R23.2
A4
  Top 0.406: J5.27 66.67,60.96 79.38,60.96 D71.A
  Bottom 0.406: D71.A D72.C 80.01,55.24 R24.2
A5
  Top 0.406: J5.28 69.22,59.69 70.48,58.42 70.48,55.88 72.39,53.98 81.28,53.98 R19.2
  Bottom 0.406: D56.A D57.C 85.09,55.24 R19.2
A6  (via drill 0.5 pad 1.02)
  Top 0.406: J5.29 64.14,62.23 63.5,61.59 48.9,61.59 46.35,59.05 22.86,59.05 v22.23,59.69
  Bottom 0.406: D98.A D99.C 24.77,70.48 R33.2 v22.23,59.69
A7  (via drill 0.5 pad 1.02)
  Top 0.406: J5.30 66.67,63.5 64.14,63.5 62.87,62.23 48.26,62.23 47.62,61.59 27.94,61.59 v27.3,62.23
  Bottom 0.406: v27.3,62.23 R25.2 29.84,70.48 D75.C D74.A
A8  (via drill 0.5 pad 1.02)
  Top 0.406: J5.31 64.14,64.77 62.23,62.87 47.62,62.87 46.99,62.23 33.02,62.23 v32.38,62.87
  Bottom 0.406: v32.38,62.87 R26.2 34.92,70.48 D78.C D77.A
A9  (via drill 0.5 pad 1.02)
  Top 0.406: J5.32 66.67,66.04 64.14,66.04 61.59,63.5 46.99,63.5 46.35,62.87 38.1,62.87 v37.47,63.5
  Bottom 0.406: v37.47,63.5 R27.2 40.01,70.48 D81.C D80.A
A10  (via drill 0.5 pad 1.02)
  Top 0.406: J5.33 64.14,67.31 60.96,64.14 v42.55,64.14
  Bottom 0.406: v42.55,64.14 R28.2 45.09,70.48 D84.C D83.A
A11
  Top 0.406: J5.34 66.67,68.58 57.78,68.58 57.15,69.22 48.9,69.22 R29.2
  Bottom 0.406: D86.A D87.C 50.16,70.48 R29.2
A12  (via drill 0.5 pad 1.02)
  Top 0.406: J5.35 55.88,69.85 v55.24,70.48
  Bottom 0.406: D89.A D90.C v55.24,70.48 R30.2
A13
  Top 0.406: J5.36 68.58,69.85 70.48,67.94 R31.2
  Bottom 0.406: D92.A D93.C 80.01,70.48 R31.2
A14
  Top 0.406: J5.37 66.67,71.12 69.85,71.12 71.12,69.85 80.64,69.85 R32.2
  Bottom 0.406: D95.A D96.C 85.09,70.48 R32.2
A15
  Top 0.406: J5.38 70.48,72.39 72.39,70.48 86.36,70.48 87.63,69.22 R34.2
  Bottom 0.406: D101.A D102.C 90.17,70.48 R34.2
AIN_0
  Bottom 0.406: J2.5 43.18,85.72 41.91,84.45 31.75,84.45 31.11,83.82 31.11,59.05 R20.1
AIN_1
  Bottom 0.406: J2.6 44.45,87.63 44.45,84.45 43.81,83.82 36.83,83.82 36.2,83.19 36.2,59.05 R21.1
AIN_2
  Bottom 0.406: J2.7 45.72,83.82 45.09,83.19 41.91,83.19 41.27,82.55 41.27,59.05 R22.1
AIN_3
  Bottom 0.406: J2.8 46.99,87.63 46.99,83.82 46.35,83.19 46.35,59.05 R23.1
AIN_4  (via drill 0.5 pad 1.02)
  Top 0.406: J2.9 49.53,87.63 49.53,90.17 50.16,90.81 v75.56,90.81
  Bottom 0.406: v75.56,90.81 75.56,59.69 R24.1
AIN_5  (via drill 0.5 pad 1.02)
  Top 0.406: J2.10 48.26,91.44 48.9,92.08 v81.28,92.08
  Bottom 0.406: v81.28,92.08 81.28,59.05 R19.1
AIN_6  (via drill 0.5 pad 1.02)
  Top 0.406: v48.26,79.38 22.86,79.38 22.23,78.74 R33.1
  Bottom 0.406: J2.11 50.8,85.72 49.53,84.45 48.9,84.45 48.26,83.82 v48.26,79.38
AIN_7  (via drill 0.5 pad 1.02)
  Top 0.406: v51.44,79.38 50.16,78.11 27.94,78.11 27.3,77.47 R25.1
  Bottom 0.406: J2.12 52.07,87.63 52.07,80.01 v51.44,79.38
AIN_8  (via drill 0.5 pad 1.02)
  Top 0.406: v52.07,78.11 51.44,77.47 33.02,77.47 32.38,76.83 R26.1
  Bottom 0.406: J2.13 53.34,85.09 52.7,84.45 52.7,78.74 v52.07,78.11
AIN_9  (via drill 0.5 pad 1.02)
  Top 0.406: v53.34,76.83 38.1,76.83 37.47,76.2 R27.1
  Bottom 0.406: J2.14 54.61,87.63 54.61,83.19 53.34,81.92 v53.34,76.83
AIN_10  (via drill 0.5 pad 1.02)
  Top 0.406: J2.15 55.88,84.45 55.24,83.82 44.45,83.82 v42.55,81.92
  Bottom 0.406: v42.55,81.92 R28.1
AIN_11  (via drill 0.5 pad 1.02)
  Top 0.406: v57.15,74.3 48.9,74.3 R29.1
  Bottom 0.406: J2.16 57.15,87.63 57.15,84.45 57.78,83.82 57.78,74.93 v57.15,74.3
AIN_12  (via drill 0.5 pad 1.02)
  Top 0.406: v58.42,71.75 53.98,71.75 R30.1
  Bottom 0.406: J2.17 v58.42,71.75
AIN_13  (via drill 0.5 pad 1.02)
  Top 0.406: J2.18 59.69,87.63 59.69,84.45 60.96,83.19 v77.47,83.19
  Bottom 0.406: v77.47,83.19 R31.1
AIN_14  (via drill 0.5 pad 1.02)
  Top 0.406: J2.19 v82.55,86.36
  Bottom 0.406: v82.55,86.36 R32.1
AIN_15  (via drill 0.5 pad 1.02)
  Top 0.406: J2.20 87,88.9 v87.63,88.27
  Bottom 0.406: v87.63,88.27 R34.1
CS
  Top 0.406: J5.19 59.05,49.53 54.61,53.98 26.04,53.98 24.77,55.24 D51.C
  Bottom 0.406: D50.A D51.C 24.77,55.24 R17.2
CSIN
  Bottom 0.406: J2.1 21.59,86.36 20.95,85.72 20.95,58.42 21.59,57.78 R17.1
GND  (via drill 0.5 pad 1.02)
  Top 0.406: D30.A 79.38,49.53 | J1.11 J1.10 | J1.1 59.69,13.97 59.69,10.79
  Top 0.61: D99.A 24.77,66.67 | 24.77,66.67 29.84,66.67 | 29.84,66.67 34.92,66.67 | 34.92,66.67 40.01,66.67 | 40.01,66.67 45.09,66.67 | 45.09,66.67 50.16,66.67 | 50.16,66.67 53.98,66.67 D90.A | D87.A 50.16,66.67 | D84.A 45.09,66.67 | D81.A 40.01,66.67 | D75.A 29.84,66.67 | D78.A 34.92,66.67 | D24.A 22.23,34.92 | 22.23,34.92 27.3,34.92 | 27.3,34.92 32.38,34.92 | 32.38,34.92 37.47,34.92 | 37.47,34.92 42.55,34.92 | 42.55,34.92 47.62,34.92 | 47.62,34.92 D9.A | D12.A 42.55,34.92 | D21.A 27.3,34.92 | D15.A 37.47,34.92 | D18.A 32.38,34.92 | D93.A 80.01,66.67 85.09,66.67 | 85.09,66.67 90.17,66.67 | 90.17,66.67 D102.A | D96.A 85.09,66.67 | D72.A 80.01,50.8 | 80.01,50.8 84.45,50.8 | 84.45,50.8 85.09,50.8 | 85.09,50.8 D57.A | D6.A 80.64,34.92 84.45,34.92 | 84.45,34.92 D3.A | 80.01,50.8 79.38,50.16 79.38,49.53 J5.20 | D27.A 84.45,50.8 | D48.A 22.23,50.8 | 22.23,50.8 24.77,50.8 | 24.77,50.8 27.3,50.8 | 27.3,50.8 29.84,50.8 | 29.84,50.8 32.38,50.8 | 32.38,50.8 34.92,50.8 | 34.92,50.8 37.47,50.8 | 37.47,50.8 40.01,50.8 | 40.01,50.8 42.55,50.8 | 42.55,50.8 45.09,50.8 | 45.09,50.8 47.62,50.8 | 47.62,50.8 50.16,50.8 D69.A | D66.A 45.09,50.8 | D36.A 42.55,50.8 | D33.A 47.62,50.8 | D39.A 37.47,50.8 | D63.A 40.01,50.8 | D60.A 34.92,50.8 | D42.A 32.38,50.8 | D54.A 29.84,50.8 | D45.A 27.3,50.8 | D51.A 24.77,50.8 | J5.9 58.42,36.83 56.52,34.92 47.62,34.92 | 14.61,70.48 14.61,95.25 36.2,95.25 | 14.61,70.48 14.61,66.67 | 14.61,66.67 14.61,50.8 | 14.61,50.8 14.61,34.92 | 14.61,34.92 22.23,34.92 | 22.23,50.8 14.61,50.8 | 24.77,66.67 14.61,66.67 | 85.09,50.8 94.61,50.8 | 94.61,50.8 94.61,66.67 | 94.61,66.67 90.17,66.67 | 84.45,34.92 94.61,34.92 94.61,50.8 | 38.1,95.25 J2.2 J2.4 | 38.1,95.25 36.2,95.25 | 36.2,95.25 PP4.1 | 38.1,95.25 v65.41,95.25 82.55,95.25 86.36,91.44 94.61,83.82 94.61,66.67
  Top 0.61: C1.2 90.17,66.67 | C3.2 14.61,70.48 | 59.69,10.79 50.8,10.79 | 50.8,10.79 38.1,10.79 | 38.1,10.79 14.61,10.79 14.61,31.11 | 14.61,31.11 14.61,34.92 | C2.1 14.61,31.11 | J1.20 38.1,10.79 | J1.10 50.8,10.79 | C4.1 PP4.1 | PP4.1 PP5.1 PP6.1
  Bottom 0.406: C4.1 R65.1 | J5.22 J5.20 J5.18
  Bottom 0.61: J5.39 v65.41,95.25
RD0
  Top 0.406: J5.1 65.41,24.77 66.67,23.5 83.82,23.5 84.45,24.13 D2.A
  Bottom 0.406: R1.2 87,31.11 D3.C D2.A
RD1
  Top 0.406: J5.2 68.58,26.67 69.22,26.04 D5.A
  Bottom 0.406: D5.A D6.C 81.92,31.11 R2.2
RD2
  Top 0.406: J5.3 55.24,29.21 53.34,27.3 48.9,27.3 D9.C
  Bottom 0.406: R3.2 50.16,31.11 D9.C D8.A
RD3
  Top 0.406: J5.4 66.67,30.48 60.96,30.48 60.33,29.84 43.81,29.84 D12.C
  Bottom 0.406: D11.A D12.C 42.55,29.84 45.09,32.38 R4.2
RD4
  Top 0.406: J5.5 60.96,31.75 59.69,30.48 39.37,30.48 D15.C
  Bottom 0.406: D14.A D15.C 37.47,29.84 40.01,32.38 R5.2
RD5
  Top 0.406: J5.6 66.67,33.02 60.96,33.02 59.05,31.11 33.66,31.11 32.38,29.84 D18.C
  Bottom 0.406: D17.A D18.C 32.38,29.84 34.92,32.38 R6.2
RD6
  Top 0.406: J5.7 60.96,34.29 58.42,31.75 30.48,31.75 D21.C
  Bottom 0.406: D20.A D21.C 27.3,29.84 29.84,32.38 R7.2
RD7
  Top 0.406: J5.8 66.67,35.56 60.96,35.56 57.78,32.38 26.04,32.38 R8.2
  Bottom 0.406: D23.A D24.C 22.23,29.84 24.77,32.38 R8.2
RDIN_0  (via drill 0.5 pad 1.02)
  Top 0.406: J1.2 85.72,12.7 v87,13.97
  Bottom 0.406: v87,13.97 R1.1
RDIN_1  (via drill 0.5 pad 1.02)
  Top 0.406: J1.3 58.42,15.88 59.69,17.14 80.64,17.14 v81.92,15.88
  Bottom 0.406: v81.92,15.88 R2.1
RDIN_2
  Bottom 0.406: J1.4 57.15,13.97 57.15,26.67 55.24,28.57 R3.1
RDIN_3  (via drill 0.5 pad 1.02)
  Top 0.406: v55.88,24.13 55.24,24.77 45.72,24.77 45.09,25.4 R4.1
  Bottom 0.406: J1.5 v55.88,24.13
RDIN_4  (via drill 0.5 pad 1.02)
  Top 0.406: v54.61,23.5 53.98,24.13 40.64,24.13 40.01,24.77 R5.1
  Bottom 0.406: J1.6 54.61,13.97 v54.61,23.5
RDIN_5  (via drill 0.5 pad 1.02)
  Top 0.406: v53.34,22.86 52.7,23.5 35.56,23.5 34.92,24.13 R6.1
  Bottom 0.406: J1.7 v53.34,22.86
RDIN_6  (via drill 0.5 pad 1.02)
  Top 0.406: v52.07,22.23 51.44,22.86 30.48,22.86 29.84,23.5 R7.1
  Bottom 0.406: J1.8 52.07,13.97 v52.07,22.23
RDIN_7  (via drill 0.5 pad 1.02)
  Top 0.406: v50.8,21.59 50.16,22.23 25.4,22.23 24.77,22.86 R8.1
  Bottom 0.406: J1.9 v50.8,21.59
WD0
  Top 0.406: J5.10 73.03,36.83 73.66,37.47 83.82,37.47 84.45,38.1 D26.A
  Bottom 0.406: R9.2 87,46.35 D27.C D26.A
WD1
  Top 0.406: J5.11 66.67,38.1 78.11,38.1 79.38,39.37 D29.A
  Bottom 0.406: D29.A D30.C 81.92,46.35 R10.2
WD2
  Top 0.406: J5.12 66.67,40.64 62.23,40.64 60.33,42.55 48.9,42.55 D33.C
  Bottom 0.406: D32.A D33.C 50.16,46.35 R11.2
WD3
  Top 0.406: J5.13 62.23,41.91 59.05,45.09 43.18,45.09 42.55,44.45 D36.C
  Bottom 0.406: R12.2 45.09,46.35 D36.C D35.A
WD4
  Top 0.406: J5.14 66.67,43.18 62.23,43.18 59.69,45.72 38.1,45.72 37.47,45.09 D39.C
  Bottom 0.406: D38.A D39.C 40.01,46.35 R13.2
WD5
  Top 0.406: J5.15 62.23,44.45 60.33,46.35 33.02,46.35 32.38,45.72 D42.C
  Bottom 0.406: D41.A D42.C 34.92,46.35 R14.2
WD6
  Top 0.406: J5.16 66.67,45.72 62.23,45.72 60.96,46.99 28.57,46.99 27.3,45.72 D45.C
  Bottom 0.406: D44.A D45.C 29.84,46.35 R15.2
WD7
  Top 0.406: J5.17 64.14,46.99 63.5,47.62 24.13,47.62 22.23,45.72 D48.C
  Bottom 0.406: D47.A D48.C 24.77,46.35 R16.2
WDIN_0  (via drill 0.5 pad 1.02)
  Top 0.406: J1.12 46.99,13.97 46.99,16.51 48.26,17.78 88.27,17.78 v88.9,18.41
  Bottom 0.406: v88.9,18.41 88.9,41.91 R9.1
WDIN_1  (via drill 0.5 pad 1.02)
  Top 0.406: J1.13 45.72,17.14 46.99,18.41 76.2,18.41 v76.83,19.05
  Bottom 0.406: v76.83,19.05 76.83,36.2 78.11,37.47 80.64,37.47 81.92,38.73 R10.1
WDIN_2
  Bottom 0.406: J1.14 44.45,13.97 44.45,20.95 46.35,22.86 46.35,29.21 48.9,31.75 48.9,34.92 50.16,36.2 R11.1
WDIN_3
  Bottom 0.406: J1.15 43.18,16.51 43.81,17.14 43.81,29.84 46.35,32.38 46.35,38.1 45.09,39.37 R12.1
WDIN_4  (via drill 0.5 pad 1.02)
  Top 0.406: J1.16 41.91,13.97 41.91,17.78 41.27,18.41 39.37,18.41 v38.73,19.05
  Bottom 0.406: v38.73,19.05 38.73,29.84 41.27,32.38 41.27,38.1 40.01,39.37 R13.1
WDIN_5  (via drill 0.5 pad 1.02)
  Top 0.406: J1.17 40.64,17.14 40.01,17.78 34.29,17.78 v33.66,18.41
  Bottom 0.406: v33.66,18.41 33.66,29.21 36.2,31.75 36.2,38.1 34.92,39.37 R14.1
WDIN_6  (via drill 0.5 pad 1.02)
  Top 0.406: J1.18 39.37,13.97 39.37,16.51 38.73,17.14 v28.57,17.14
  Bottom 0.406: v28.57,17.14 28.57,29.21 31.11,31.75 31.11,38.1 29.84,39.37 R15.1
WDIN_7  (via drill 0.5 pad 1.02)
  Top 0.406: J1.19 v23.5,15.24
  Bottom 0.406: v23.5,15.24 23.5,29.21 26.04,31.75 26.04,38.73 24.77,40.01 R16.1
WRITE
  Top 0.406: J5.21 57.78,52.07 55.24,54.61 30.48,54.61 29.84,55.24 D54.C
  Bottom 0.406: D53.A D54.C 29.84,55.24 R18.2
WRITEIN
  Bottom 0.406: J2.3 39.37,85.09 26.67,85.09 26.04,84.45 26.04,59.05 R18.1

### Text on the board
tPlace: 0V | 5V | ADDRESS | WRITE | 3 | 2 | 1 | 0 | READ | MEM_P2P_1 | James Newman